# Altium project Geo tracker.PrjPcb
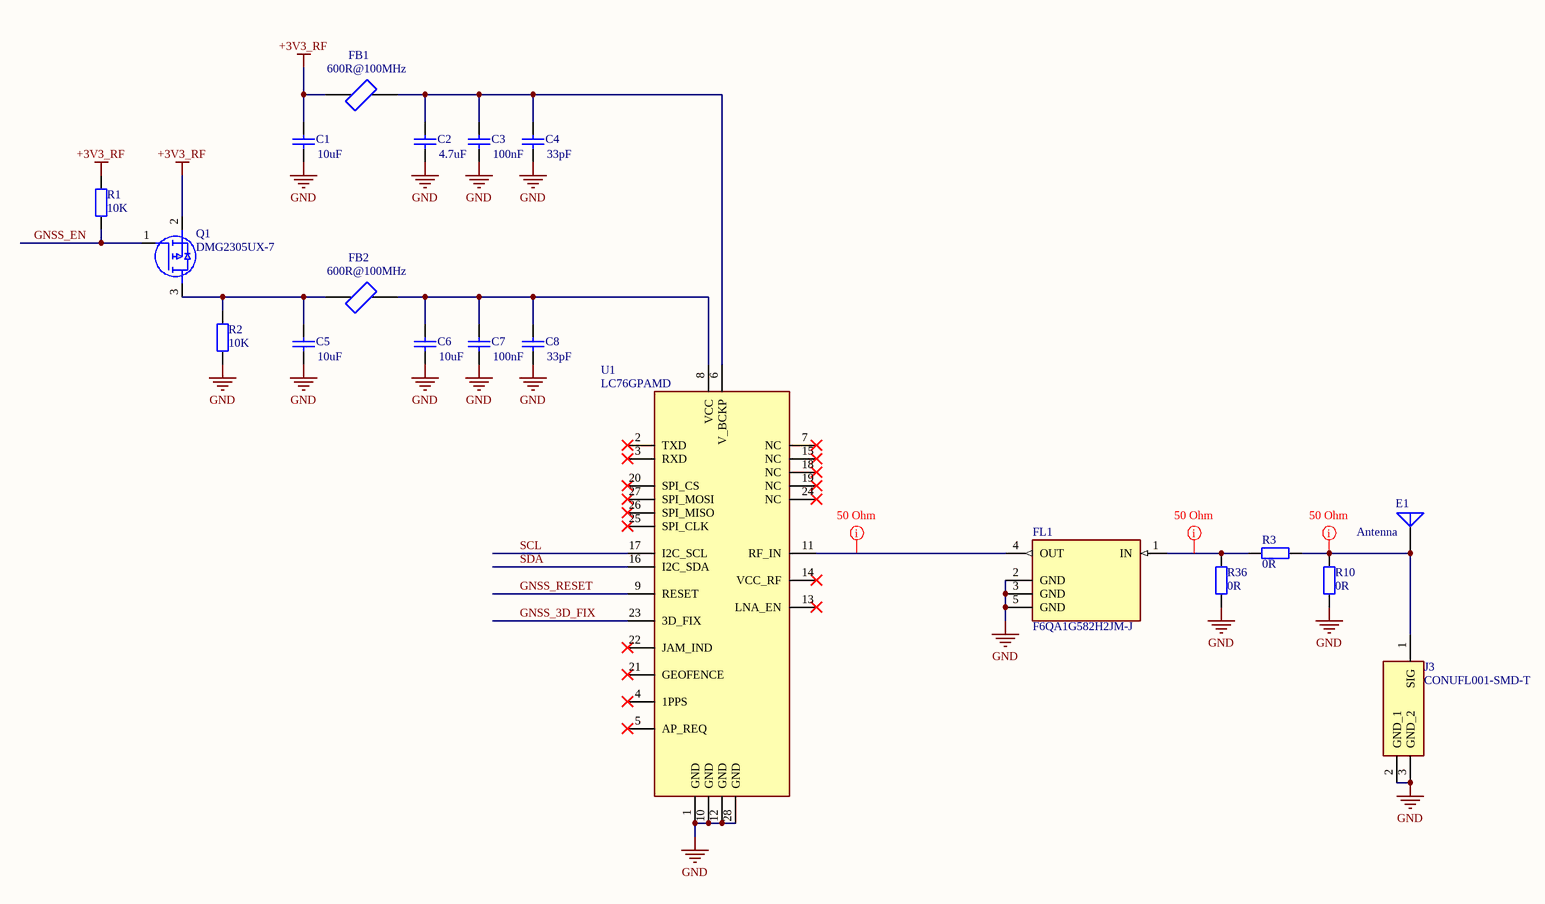
[diagram p0: GNSS modulis.SchDoc]
6 sheets, 193 parts. Net scope: global (net labels, ports and power ports of the same name join across sheets).
Board files: PCB1.PcbDoc, PCB1.PcbDoc
Sheets:
  GNSS modulis.SchDoc
  Connectors.SchDoc
  Battery charger.SchDoc
  RF Front End.SchDoc
  Power.SchDoc
  MCU.SchDoc

## Sheet GNSS modulis.SchDoc
size B; SheetNumber: 1; SheetTotal: 6

### Parts
C1  10uF  [SMD-0805C]
C2  4.7uF  [SMD-0603C]
C3  100nF  [SMD-0402C]
C4  33pF  [SMD-0402C]
C5  10uF  [SMD-0805C]
C6  10uF  [SMD-0805C]
C7  100nF  [SMD-0402C]
C8  33pF  [SMD-0402C]
E1  Antenna  [204286-0001_MOL]
FB1  600R@100MHz  [0402 Ferrite Bead]
FB2  600R@100MHz  [0402 Ferrite Bead]
FL1  F6QA1G582H2JM-J  [FIL_F6QA1G582H2JM-J]
J3  CONUFL001-SMD-T  [CONUFL001SMDT]
Q1  DMG2305UX-7  [DMG2305UX-7]
R1  10K  [SMD-0402-RES]
R2  10K  [SMD-0402-RES]
R3  0R  [SMD-0402-RES]
R10  0R  [SMD-0402-RES]
R36  0R  [SMD-0402-RES]
U1  LC76GPAMD  [LC76GPAMD]

### Nets
+3V3_RF: C1.2 FB1.1 Q1.2(S) R1.2
GND: C1.1 C2.1 C3.1 C4.1 C5.1 C6.1 C7.1 C8.1 FL1.2(GND) FL1.3(GND) FL1.5(GND) J3.2(GND_1) J3.3(GND_2) R2.1 R10.1 R36.1 U1.1(GND) U1.10(GND) U1.12(GND) U1.28(GND)
GNSS_3D_FIX: U1.23(3D_FIX)
GNSS_EN: Q1.1(G) R1.1
GNSS_RESET: U1.9(RESET)
SCL: U1.17(I2C_SCL)
SDA: U1.16(I2C_SDA)
NetC2_2: C2.2 C3.2 C4.2 FB1.2 U1.6(V_BCKP)
NetC5_2: C5.2 FB2.1 Q1.3(D) R2.2
NetC6_2: C6.2 C7.2 C8.2 FB2.2 U1.8(VCC)
NetE1_1: E1.1(A) J3.1(SIG) R3.1 R10.2
NetFL1_1: FL1.1(IN) R3.2 R36.2
NetFL1_4: FL1.4(OUT) U1.11(RF_IN)

Not connected (* = marked no-connect by the designer): U1 2(TXD)* 3(RXD)* 4(1PPS)* 5(AP_REQ)* 7(NC)* 13(LNA_EN)* 14(VCC_RF)* 15(NC)* 18(NC)* 19(NC)* 20(SPI_CS)* 21(GEOFENCE)* 22(JAM_IND)* 24(NC)* 25(SPI_CLK)* 26(SPI_MISO)* 27(SPI_MOSI)*

### Layout directives
net class 50 Ohm BLE GNSS: NetE1_1, NetFL1_1, NetFL1_4

### Library data of the parts
C1-C8 = Cap: Capacitor; Published: 8-Jun-2000; LatestRevisionDate: 17-Jul-2002; LatestRevisionNote: Re-released for DXP Platform.; PackageReference: RAD-0.3; Publisher: Altium Limited; PackageDescription: Radial Cap, Thru-Hole; 2 Leads; 0.3 in Pin Spacing; Supplier 1: Mouser
  C1 C5 C6: Value: 10uF; Supplier Part Number 1: 187-CL21A106KOQNNNG
  C2: Value: 4.7uF; Supplier Part Number 1: 187-CL10A475KO8NNNC
  C3 C7: Value: 100nF; Supplier Part Number 1: 603-CC402KRX7R7BB104
  C4 C8: Value: 33pF; Supplier Part Number 1: 81-GCM1555C1H330JA6D
E1 = Antenna: Generic Antenna; Published: 24-Mar-1999; LatestRevisionDate: 17-Jul-2002; LatestRevisionNote: Re-released for DXP Platform.; PackageReference: PIN1; Publisher: Altium Limited; Supplier 1: Mouser; Supplier Part Number 1: 538-204286-0001
FB1 FB2 = Ferrite: Ferrite Beads FERRITE BEAD 600 OHM 0402 1LN; MF: Laird-Signal Integrity Products; MP: MI0805K400R-10; SnapEDA_Link: https://www.snapeda.com/parts/MI0805K400R-10/Laird-Signal+Integrity+Products/view-part/?ref=snap; Package: 0805 Laird; Value: *; Check_prices: https://www.snapeda.com/parts/MI0805K400R-10/Laird-Signal+Integrity+Products/view-part/?ref=eda; Supplier 1: Mouser; Supplier Part Number 1: 81-BLM15AX601SN1D
FL1 = F6QA1G582H2JM-J: 1.582GHz Frequency GPS RF SAW Filter (Surface Acoustic Wave) 1.8dB  Bandwidth 5-SMD, No Lead; MF: Taiyo Yuden; SnapEDA_Link: https://www.snapeda.com/parts/F6QA1G582H2JM-J/Taiyo+Yuden/view-part/?ref=snap; Package: SMD-5 Taiyo Yuden; Value: *; MP: F6QA1G582H2JM-J; Check_prices: https://www.snapeda.com/parts/F6QA1G582H2JM-J/Taiyo+Yuden/view-part/?ref=eda; Supplier 1: Mouser; Supplier Part Number 1: 963-F6QA1G582H2JM-J
J3 = CONUFL001-SMD-T: Connector; Manufacturer_Name: TE Connectivity; Datasheet Link: https://eu.mouser.com/datasheet/2/418/9/ENG_DS_CONUFL001_SMD_T_B-3238717.pdf; Height: 1.3mm; Manufacturer_Part_Number: CONUFL001-SMD-T; Mouser Part Number: N/A; Mouser Price/Stock: https://www.mouser.co.uk/ProductDetail/TE-Connectivity/CONUFL001-SMD-T?qs=3Rah4i%252BhyCHmRzMH%252BkLkPQ%3D%3D; Arrow Part Number: CONUFL001-SMD-T; Arrow Price/Stock: https://www.arrow.com/en/products/conufl001-smd-t/te-connectivity?utm_currency=USD&region=europe; Supplier 1: Mouser; Supplier Part Number 1: 712-CONUFL001-SMD-T
Q1 = DMG2305UX-7: MOSFET P-Ch 20V 5A Enhancement SOT23 Diodes Inc DMG2305UX-7 P-channel MOSFET Transistor, -3.3 A, -20 V, 3-Pin SOT-23; Manufacturer_Name: Diodes Incorporated; Geometry.Height: 1.15mm; Mouser Part Number: 621-DMG2305UX-7; Mouser Price/Stock: https://www.mouser.co.uk/ProductDetail/Diodes-Incorporated/DMG2305UX-7?qs=L1DZKBg7t5F%2FNBHrjfxC%252Bg%3D%3D; Manufacturer_Part_Number: DMG2305UX-7; Datasheet Link: https://www.diodes.com//assets/Datasheets/DMG2305UX.pdf; Supplier 1: Mouser; Supplier Part Number 1: 621-DMG2305UX-7
R1-R3 R10 R36 = Res2: Resistor; Published: 8-Jun-2000; LatestRevisionDate: 17-Jul-2002; LatestRevisionNote: Re-released for DXP Platform.; PackageReference: AXIAL-0.4; Publisher: Altium Limited; PackageDescription: Axial Device, Thru-Hole; 2 Leads; 0.4 in Pin Spacing; Supplier 1: Mouser
  R1 R2: Value: 10K; Supplier Part Number 1: 603-RC0402FR-7D10KL
  R3 R10 R36: Value: 0R; Supplier Part Number 1: 603-RC0402FR-070RL
U1 = LC76GPAMD: Manufacturer_Name: Quectel; Datasheet Link: https://www.mouser.es/pdfDocs/L76_and_LC76_series_Hardware_Comparison_V1020220515.pdf; Height: 2.7mm; Manufacturer_Part_Number: LC76GPAMD; Mouser Part Number: 277-LC76GPAMD; Mouser Price/Stock: https://www.mouser.co.uk/ProductDetail/Quectel/LC76GPAMD?qs=vvQtp7zwQdMfDuCTmjRUww%3D%3D; Arrow Part Number: LC76GPAMD; Arrow Price/Stock: https://www.arrow.com/en/products/lc76gpamd/quectel-wireless-solutions-co-ltd?utm_currency=USD&region=nac; Supplier 1: Mouser; Supplier Part Number 1: 277-LC76GPAMD

## Sheet Connectors.SchDoc
size A; SheetNumber: 2; SheetTotal: 6
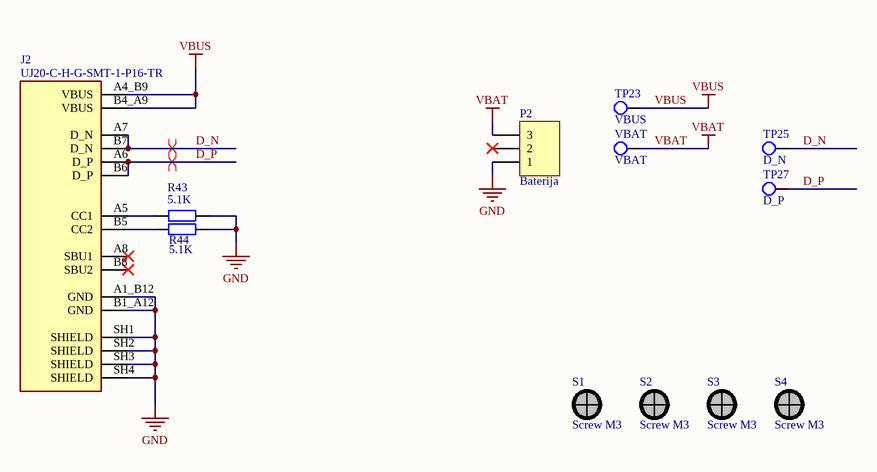
[diagram p1: Connectors.SchDoc]

### Parts
J2  UJ20-C-H-G-SMT-1-P16-TR  [SAMESKY_UJ20-C-H-G-SMT-1-P16-TR]
P2  Baterija  [S3B-XH-A-1(LF)(SN)]
R43  5.1K  [SMD-0402-RES]
R44  5.1K  [SMD-0402-RES]
S1  Screw M3  [M3]
S2  Screw M3  [M3]
S3  Screw M3  [M3]
S4  Screw M3  [M3]
TP23  VBUS  [testpoint 1 mm]  (no BOM)
TP25  D_N  [testpoint 1 mm]  (no BOM)
TP27  D_P  [testpoint 1 mm]  (no BOM)
VBAT  VBAT  [testpoint 1 mm]  (no BOM)

### Nets
GND: J2.A1_B12(GND) J2.B1_A12(GND) J2.SH1(SHIELD) J2.SH2(SHIELD) J2.SH3(SHIELD) J2.SH4(SHIELD) P2.1 R43.1 R44.1
VBAT: P2.3 VBAT.1
VBUS: J2.A4_B9(VBUS) J2.B4_A9(VBUS) TP23.1
D_N: J2.A7(D_N) J2.B7(D_N) TP25.1
D_P: J2.A6(D_P) J2.B6(D_P) TP27.1
NetJ2_A5: J2.A5(CC1) R43.2
NetJ2_B5: J2.B5(CC2) R44.2

Not connected (* = marked no-connect by the designer): J2 A8(SBU1)* B8(SBU2)*; P2 2*

### Layout directives
differential pair: D_N, D_P

### Library data of the parts
J2 = UJ20-C-H-G-SMT-1-P16-TR: USB-C (USB TYPE-C) USB 2.0 Receptacle Connector 24 (16+8 Dummy) Position Surface Mount, Right Angle; Through Hole; MF: Same Sky; SnapEDA_Link: https://www.snapeda.com/parts/UJ20-C-H-G-SMT-1-P16-TR/Same+Sky/view-part/?ref=snap; Package: None; Value: *; MP: UJ20-C-H-G-SMT-1-P16-TR; Check_prices: https://www.snapeda.com/parts/UJ20-C-H-G-SMT-1-P16-TR/Same+Sky/view-part/?ref=eda; Supplier 1: Mouser; Supplier Part Number 1: 179-UJ20CHGSMT1P16TR
P2 = Header 3: S3B-XH-A-1(LF)(SN); LatestRevisionDate: 17-Jul-2002; LatestRevisionNote: Re-released for DXP Platform.; Publisher: Altium Limited; Supplier 1: Mouser; Supplier Part Number 1: 306-S3BXHA1LFSN
R43 R44 = Res2: Resistor; Published: 8-Jun-2000; LatestRevisionDate: 17-Jul-2002; LatestRevisionNote: Re-released for DXP Platform.; PackageReference: AXIAL-0.4; Publisher: Altium Limited; PackageDescription: Axial Device, Thru-Hole; 2 Leads; 0.4 in Pin Spacing; Value: 5.1K; Supplier 1: Mouser; Supplier Part Number 1: 708-RMCF0402FT5K10
TP23 TP25 TP27 VBAT = testpoint

## Sheet Battery charger.SchDoc
size A; SheetNumber: 3; SheetTotal: 6
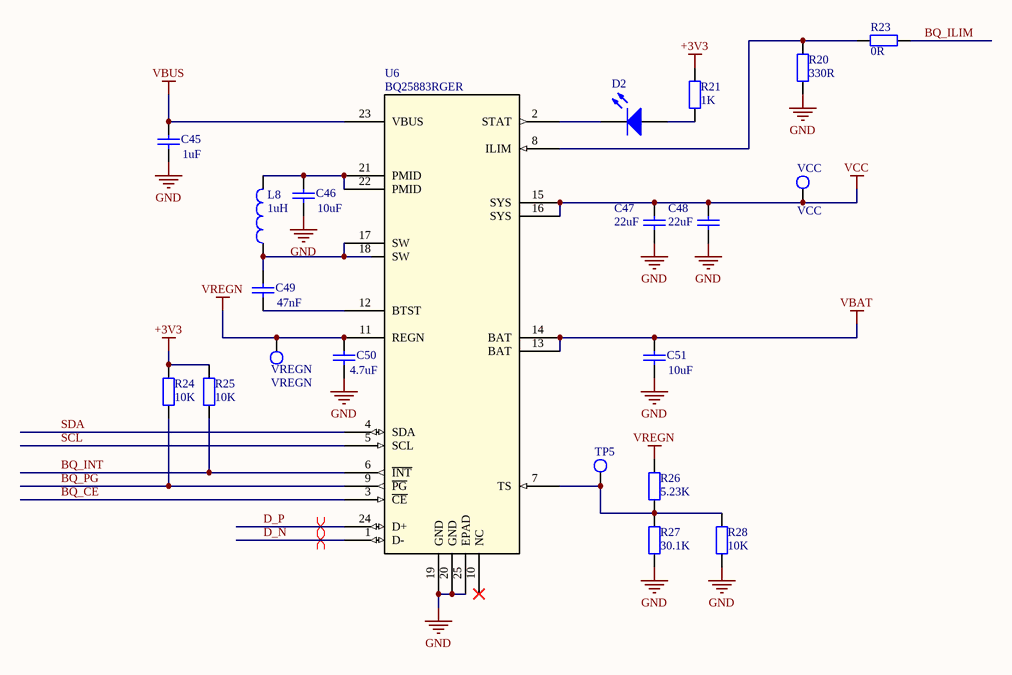
[diagram p2: Battery charger.SchDoc]

### Parts
C45  1uF  [SMD-0402C]
C46  10uF  [SMD-0805C]
C47  22uF  [SMD-0805C]
C48  22uF  [SMD-0805C]
C49  47nF  [SMD-0402C]
C50  4.7uF  [SMD-0603C]
C51  10uF  [SMD-0805C]
D2  (no value)  [LED 0603]
L8  1uH  [SMD-0806_L]
R20  330R  [SMD-0402-RES]
R21  1K  [SMD-0402-RES]
R23  0R  [SMD-0402-RES]
R24  10K  [SMD-0402-RES]
R25  10K  [SMD-0402-RES]
R26  5.23K  [SMD-0402-RES]
R27  30.1K  [SMD-0402-RES]
R28  10K  [SMD-0402-RES]
TP5  VREGN  [testpoint 1 mm]  (value not drawn)  (no BOM)
U6  BQ25883RGER  [BQ25883RGER]
VCC  VCC  [testpoint 1 mm]  (no BOM)
VREGN  VREGN  [testpoint 1 mm]  (no BOM)

### Nets
+3V3: R21.1 R24.2 R25.2
GND: C45.1 C46.1 C47.1 C48.1 C50.1 C51.1 R20.1 R27.1 R28.1 U6.19(GND) U6.20(GND) U6.25(EPAD)
VBAT: C51.2 U6.13(BAT) U6.14(BAT)
VBUS: C45.2 U6.23(VBUS)
VCC: C47.2 C48.2 U6.15(SYS) U6.16(SYS) VCC.1
VREGN: C50.2 R26.2 U6.11(REGN) VREGN.1
BQ_CE: U6.3(~{CE})
BQ_ILIM: R23.1
BQ_INT: R25.1 U6.6(~{INT})
BQ_PG: R24.1 U6.9(~{PG})
D_N: U6.1(D-)
D_P: U6.24(D+)
SCL: U6.5(SCL)
SDA: U6.4(SDA)
NetC46_2: C46.2 L8.2 U6.21(PMID) U6.22(PMID)
NetC49_1: C49.1 U6.12(BTST)
NetC49_2: C49.2 L8.1 U6.17(SW) U6.18(SW)
NetD2_1: D2.1(A) R21.2
NetD2_2: D2.2(K) U6.2(STAT)
NetR20_2: R20.2 R23.2 U6.8(ILIM)
NetR26_1: R26.1 R27.2 R28.2 TP5.1 U6.7(TS)

Not connected (* = marked no-connect by the designer): U6 10(NC)*

### Layout directives
differential pair: D_N, D_P

### Library data of the parts
C45-C51 = Cap: Capacitor; Published: 8-Jun-2000; LatestRevisionDate: 17-Jul-2002; LatestRevisionNote: Re-released for DXP Platform.; PackageReference: RAD-0.3; Publisher: Altium Limited; PackageDescription: Radial Cap, Thru-Hole; 2 Leads; 0.3 in Pin Spacing; Supplier 1: Mouser
  C45: Value: 1uF; Supplier Part Number 1: 81-GRM155R61E105KA2D
  C46 C51: Value: 10uF; Supplier Part Number 1: 187-CL21A106KOQNNNG
  C47 C48: Value: 22uF; Supplier Part Number 1: 187-CL21A226MAYNNNE
  C49: Value: 47nF; Supplier Part Number 1: 81-GRM155R71H473KE4D
  C50: Value: 4.7uF; Supplier Part Number 1: 187-CL10A475KO8NNNC
D2 = LED1: Single Colour LEDs SMD Green 2.5-16 mcd; Published: 8-Jun-2000; LatestRevisionDate: 08-Jul-2005; LatestRevisionNote: Mech Layer 1 removed.; PackageReference: LED-1; Publisher: Altium Limited; PackageDescription: LED; 2 Leads; Supplier 1: Mouser; Supplier Part Number 1: 755-SML-D12P8WT86
L8 = Inductor: Code_IEC: 1005; Published: 8-Jun-2000; LatestRevisionDate: 29-May-2009; LatestRevisionNote: IPC-7351 Footprint Added.; PackageReference: 0402-A; Publisher: Altium Limited; PackageDescription: Chip Inductor; Code_JEITA: 0402; Value: 1uH; Supplier 1: Mouser; Supplier Part Number 1: 815-AOTB201610S1R0MT
R20 R21 R23-R28 = Res2: Resistor; Published: 8-Jun-2000; LatestRevisionDate: 17-Jul-2002; LatestRevisionNote: Re-released for DXP Platform.; PackageReference: AXIAL-0.4; Publisher: Altium Limited; PackageDescription: Axial Device, Thru-Hole; 2 Leads; 0.4 in Pin Spacing; Supplier 1: Mouser
  R20: Value: 330R; Supplier Part Number 1: 652-CR0402FX-3300GLF
  R21: Value: 1K; Supplier Part Number 1: 708-RMCF0402FT1K00
  R23: Value: 0R; Supplier Part Number 1: 603-RC0402FR-070RL
  R24 R25 R28: Value: 10K; Supplier Part Number 1: 603-RC0402FR-7D10KL
  R26: Value: 5.23K; Supplier Part Number 1: 708-RMCF0402FT5K23
  R27: Value: 30.1K; Supplier Part Number 1: 708-RMCF0402FT30K1
TP5 VCC VREGN = testpoint
U6 = BQ25883RGER: I2C 2 cell 2A Boost battery charger for USB input in a WQFN package with Power Path 24-VQFN -40 to 85; Manufacturer_Name: Texas Instruments; Copyright: Copyright (C) 2025 Ultra Librarian. All rights reserved.; Manufacturer_Part_Number: BQ25883RGER; RefDes: RefDes; Type: Type; Supplier 1: Mouser; Supplier Part Number 1: 595-BQ25883RGER

## Sheet RF Front End.SchDoc
size B; SheetNumber: 4; SheetTotal: 6
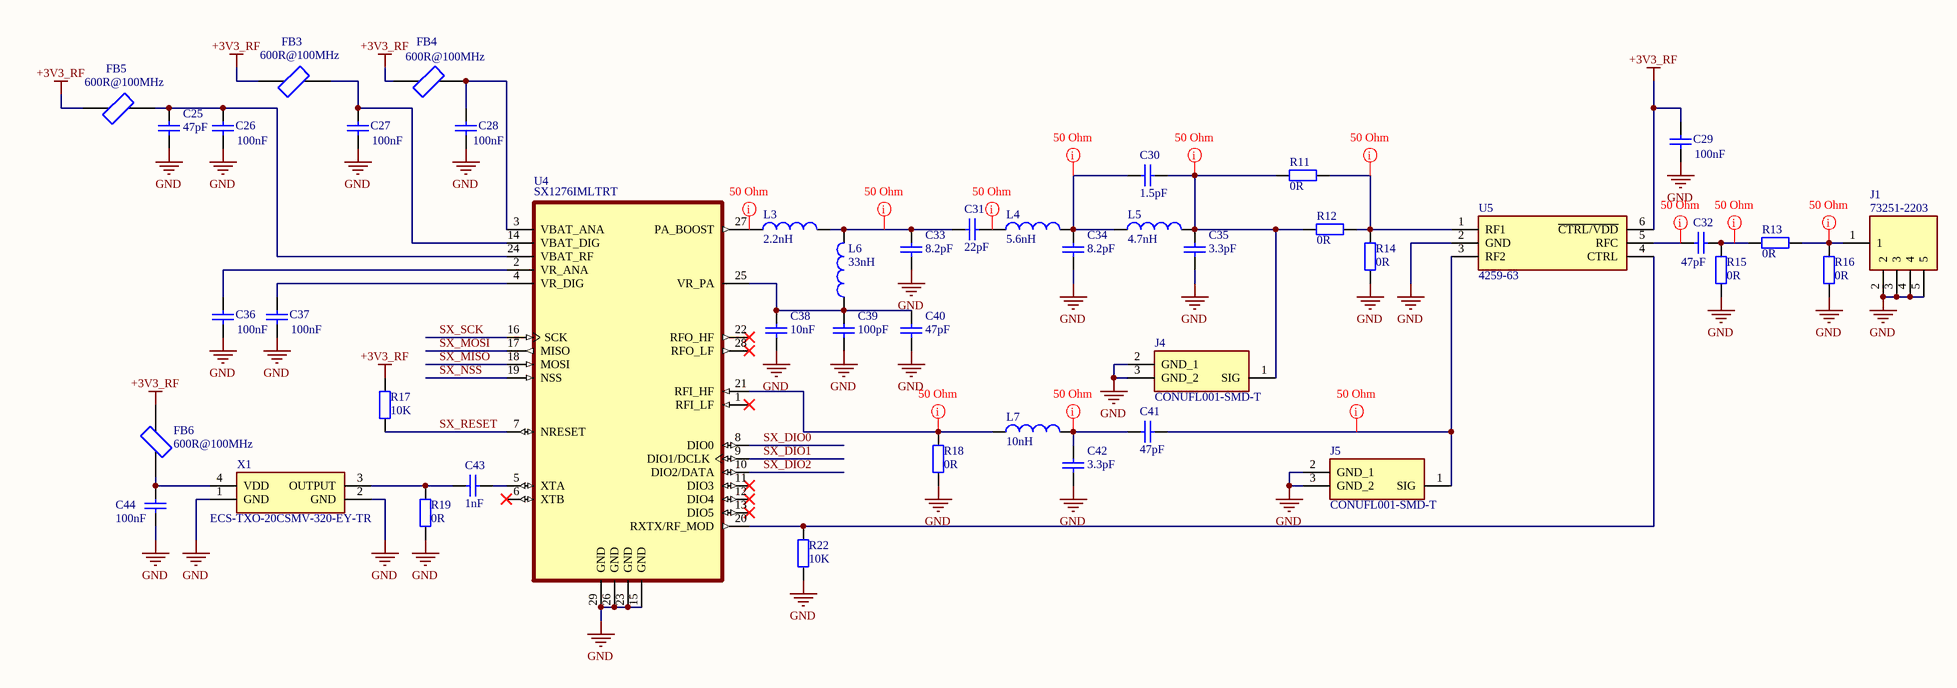
[diagram p3: RF Front End.SchDoc]

### Parts
C25  47pF  [SMD-0402C]
C26  100nF  [SMD-0402C]
C27  100nF  [SMD-0402C]
C28  100nF  [SMD-0402C]
C29  100nF  [SMD-0402C]
C30  1.5pF  [SMD-0402C]
C31  22pF  [SMD-0402C]
C32  47pF  [SMD-0402C]
C33  8.2pF  [SMD-0402C]
C34  8.2pF  [SMD-0402C]
C35  3.3pF  [SMD-0402C]
C36  100nF  [SMD-0402C]
C37  100nF  [SMD-0402C]
C38  10nF  [SMD-0402C]
C39  100pF  [SMD-0402C]
C40  47pF  [SMD-0402C]
C41  47pF  [SMD-0402C]
C42  3.3pF  [SMD-0402C]
C43  1nF  [SMD-0402C]
C44  100nF  [SMD-0402C]
FB3  600R@100MHz  [0402 Ferrite Bead]
FB4  600R@100MHz  [0402 Ferrite Bead]
FB5  600R@100MHz  [0402 Ferrite Bead]
FB6  600R@100MHz  [0402 Ferrite Bead]
J1  73251-2203  [732512203]
J4  CONUFL001-SMD-T  [CONUFL001SMDT]
J5  CONUFL001-SMD-T  [CONUFL001SMDT]
L3  2.2nH  [SMD-0402-RES]
L4  5.6nH  [SMD-0402-RES]
L5  4.7nH  [SMD-0402-RES]
L6  33nH  [SMD-0402-RES]
L7  10nH  [SMD-0402-RES]
R11  0R  [SMD-0402-RES]
R12  0R  [SMD-0402-RES]
R13  0R  [SMD-0402-RES]
R14  0R  [SMD-0402-RES]
R15  0R  [SMD-0402-RES]
R16  0R  [SMD-0402-RES]
R17  10K  [SMD-0402-RES]
R18  0R  [SMD-0402-RES]
R19  0R  [SMD-0402-RES]
R22  10K  [SMD-0402-RES]
U4  SX1276IMLTRT  [SX1276IMLTRT]
U5  4259-63  [4259-63]
X1  ECS-TXO-20CSMV-320-EY-TR  [ECS-TXO-20CSMV-320-EY-TR]

### Nets
+3V3_RF: C29.2 FB3.1 FB4.1 FB5.1 FB6.2 R17.2 U5.6(~{CTRL/}~{VDD})
GND: C25.1 C26.1 C27.1 C28.1 C29.1 C33.1 C34.1 C35.1 C36.1 C37.1 C38.1 C39.1 C40.1 C42.1 C44.1 J1.2 J1.3 J1.4 J1.5 J4.2(GND_1) J4.3(GND_2) J5.2(GND_1) J5.3(GND_2) R14.1 R15.1 R16.1 R18.1 R19.1 R22.1 U4.15(GND) U4.23(GND) U4.26(GND) U4.29(GND) U5.2(GND) X1.1(GND) X1.2(GND)
SX_DIO0: U4.8(DIO0)
SX_DIO1: U4.9(DIO1/DCLK)
SX_DIO2: U4.10(DIO2/DATA)
SX_MISO: U4.18(MOSI)
SX_MOSI: U4.17(MISO)
SX_NSS: U4.19(NSS)
SX_RESET: R17.1 U4.7(NRESET)
SX_SCK: U4.16(SCK)
NetC25_2: C25.2 C26.2 FB5.2 U4.24(VBAT_RF)
NetC27_2: C27.2 FB3.2 U4.14(VBAT_DIG)
NetC28_2: C28.2 FB4.2 U4.3(VBAT_ANA)
NetC30_1: C30.1 C35.2 J4.1(SIG) L5.2 R11.2 R12.2
NetC30_2: C30.2 C34.2 L4.2 L5.1
NetC31_1: C31.1 L4.1
NetC31_2: C31.2 C33.2 L3.2 L6.2
NetC32_1: C32.1 R13.2 R15.2
NetC32_2: C32.2 U5.5(RFC)
NetC36_2: C36.2 U4.2(VR_ANA)
NetC37_2: C37.2 U4.4(VR_DIG)
NetC38_2: C38.2 C39.2 C40.2 L6.1 U4.25(VR_PA)
NetC41_1: C41.1 J5.1(SIG) U5.3(RF2)
NetC41_2: C41.2 C42.2 L7.2
NetC43_1: C43.1 U4.5(XTA)
NetC43_2: C43.2 R19.2 X1.3(OUTPUT)
NetC44_2: C44.2 FB6.1 X1.4(VDD)
NetJ1_1: J1.1 R13.1 R16.2
NetL3_1: L3.1 U4.27(PA_BOOST)
NetL7_1: L7.1 R18.2 U4.21(RFI_HF)
NetR11_1: R11.1 R12.1 R14.2 U5.1(RF1)
NetR22_2: R22.2 U4.20(RXTX/RF_MOD) U5.4(CTRL)

Not connected (* = marked no-connect by the designer): U4 1(RFI_LF)* 6(XTB)* 11(DIO3)* 12(DIO4)* 13(DIO5)* 22(RFO_HF)* 28(RFO_LF)*

### Layout directives
net class 50 Ohm LoRa: NetC30_1, NetC30_2, NetC31_1, NetC31_2, NetC32_1, NetC32_2, NetC41_1, NetC41_2, NetJ1_1, NetL3_1, NetL7_1, NetR11_1

### Library data of the parts
C25-C44 = Cap: Capacitor; Published: 8-Jun-2000; LatestRevisionDate: 17-Jul-2002; LatestRevisionNote: Re-released for DXP Platform.; PackageReference: RAD-0.3; Publisher: Altium Limited; PackageDescription: Radial Cap, Thru-Hole; 2 Leads; 0.3 in Pin Spacing; Supplier 1: Mouser
  C25 C40: Value: 47pF; Supplier Part Number 1: 81-GRM1555C1H470JA1D
  C26-C29 C36 C37 C44: Value: 100nF; Supplier Part Number 1: 603-CC402KRX7R7BB104
  C30: Value: 1.5pF; Supplier Part Number 1: 81-GJM1555C1H1R5BB1D
  C31: Value: 22pF; Supplier Part Number 1: 81-GJM1555C1H220FB1J
  C32 C41: Value: 47pF; Supplier Part Number 1: 81-GJM1555C1H470FB1D
  C33 C34: Value: 8.2pF; Supplier Part Number 1: 81-GJM1555C1H8R2CB01
  C35 C42: Value: 3.3pF; Supplier Part Number 1: 81-GJM1555C1H3R3CB1D
  C38: Value: 10nF; Supplier Part Number 1: 791-MT15B103K500CT
  C39: Value: 100pF; Supplier Part Number 1: 187-CL05C101JB5NNNC
  C43: Value: 1nF; Supplier Part Number 1: 81-GRM36X102K50
FB3-FB6 = Ferrite: as FB1 on sheet GNSS modulis; SnapEDA_Link: https://www.snapeda.com/parts/MI0805K400R-10/Laird-Signal+Integrity+Products/view-part/?ref=snap; Package: 0805 Laird; Value: *; Check_prices: https://www.snapeda.com/parts/MI0805K400R-10/Laird-Signal+Integrity+Products/view-part/?ref=eda; Supplier 1: Mouser; Supplier Part Number 1: 81-BLM15AX601SN1D
J1 = 73251-2203: RF Connectors / Coaxial Connectors Conn 50 Ohms, SMA Jack, Right-Angle PCB, Gold; Manufacturer_Name: Molex; Geometry.Height: 10.59mm; Mouser Part Number: 538-73251-2203; Mouser Price/Stock: https://www.mouser.co.uk/ProductDetail/Molex/73251-2203?qs=KpdAywxU013Bis55GeNoeg%3D%3D; Manufacturer_Part_Number: 73251-2203; Datasheet Link: https://www.molex.com/en-us/products/part-detail-pdf/732512203?display=pdf; Supplier 1: Mouser; Supplier Part Number 1: 538-73251-2203
J4 J5 = CONUFL001-SMD-T: as J3 on sheet GNSS modulis; Datasheet Link: https://eu.mouser.com/datasheet/2/418/9/ENG_DS_CONUFL001_SMD_T_B-3238717.pdf; Height: 1.3mm; Manufacturer_Part_Number: CONUFL001-SMD-T; Mouser Part Number: N/A; Mouser Price/Stock: https://www.mouser.co.uk/ProductDetail/TE-Connectivity/CONUFL001-SMD-T?qs=3Rah4i%252BhyCHmRzMH%252BkLkPQ%3D%3D; Arrow Part Number: CONUFL001-SMD-T; Arrow Price/Stock: https://www.arrow.com/en/products/conufl001-smd-t/te-connectivity?utm_currency=USD&region=europe; Supplier 1: Mouser; Supplier Part Number 1: 712-CONUFL001-SMD-T
L3-L7 = Inductor: Code_IEC: 1005; Published: 8-Jun-2000; LatestRevisionDate: 29-May-2009; LatestRevisionNote: IPC-7351 Footprint Added.; PackageReference: 0402-A; Publisher: Altium Limited; PackageDescription: Chip Inductor; Code_JEITA: 0402; Supplier 1: Mouser
  L3: Value: 2.2nH; Supplier Part Number 1: 81-LQW15AN2N2C10D
  L4: Value: 5.6nH; Supplier Part Number 1: 81-LQW15AN5N6C10D
  L5: Value: 4.7nH; Supplier Part Number 1: 81-LQW15AN4N7B00D
  L6: Value: 33nH; Supplier Part Number 1: 81-LQW15AN33NJ00D
  L7: Value: 10nH; Supplier Part Number 1: 81-LQW15AN10NH00D
R11-R19 R22 = Res2: Resistor; Published: 8-Jun-2000; LatestRevisionDate: 17-Jul-2002; LatestRevisionNote: Re-released for DXP Platform.; PackageReference: AXIAL-0.4; Publisher: Altium Limited; PackageDescription: Axial Device, Thru-Hole; 2 Leads; 0.4 in Pin Spacing; Supplier 1: Mouser
  R11-R16 R18 R19: Value: 0R; Supplier Part Number 1: 603-RC0402FR-070RL
  R17 R22: Value: 10K; Supplier Part Number 1: 603-RC0402FR-7D10KL
U4 = SX1276IMLTRT: IC RF TxRx Only 802.15.4 LoRaâ„¢ 137MHz ~ 1.02GHz 28-VQFN Exposed Pad; MF: Semtech Corporation; SnapEDA_Link: https://www.snapeda.com/parts/SX1276IMLTRT/Semtech+Corporation/view-part/?ref=snap; Package: VQFN-28 Semtech; Value: *; MP: SX1276IMLTRT; Check_prices: https://www.snapeda.com/parts/SX1276IMLTRT/Semtech+Corporation/view-part/?ref=eda; Supplier 1: Mouser; Supplier Part Number 1: 947-SX1276IMLTRT
U5 = 4259-63: RF switch IC; Manufacturer_Name: Peregrine Semiconductor; Geometry.Height: 1.1mm; Mouser Part Number: 81-4259-63; Mouser Price/Stock: https://www.mouser.co.uk/ProductDetail/pSemi/4259-63?qs=iw0hurA%2FaD37qvQcKdATTw%3D%3D; Manufacturer_Part_Number: 4259-63; Datasheet Link: http://www.psemi.com/pdf/datasheets/pe4259ds.pdf; Supplier 1: Mouser; Supplier Part Number 1: 81-4259-63
X1 = ECS-TXO-20CSMV-320-EY-TR: TCXO Oscillators MultiVolt TCXO,32MHz,+/-2.5ppm,1.7V 3.465V,2.5 mA,-30 C 85 C, 2.00mm x 1.60mm; Manufacturer_Name: ECS; Geometry.Height: 0.8mm; Mouser Part Number: 520-TXO20CSMV320EYTR; Mouser Price/Stock: https://www.mouser.co.uk/ProductDetail/ECS/ECS-TXO-20CSMV-320-EY-TR?qs=7MVldsJ5UazLDC0xk68SAQ%3D%3D; Manufacturer_Part_Number: ECS-TXO-20CSMV-320-EY-TR; Datasheet Link: https://ecsxtal.com/store/pdf/ECS-TXO-20CSMV.pdf; Supplier 1: Mouser; Supplier Part Number 1: 520-TXO20CSMV320EYTR

## Sheet Power.SchDoc
size B; SheetNumber: 5; SheetTotal: 6
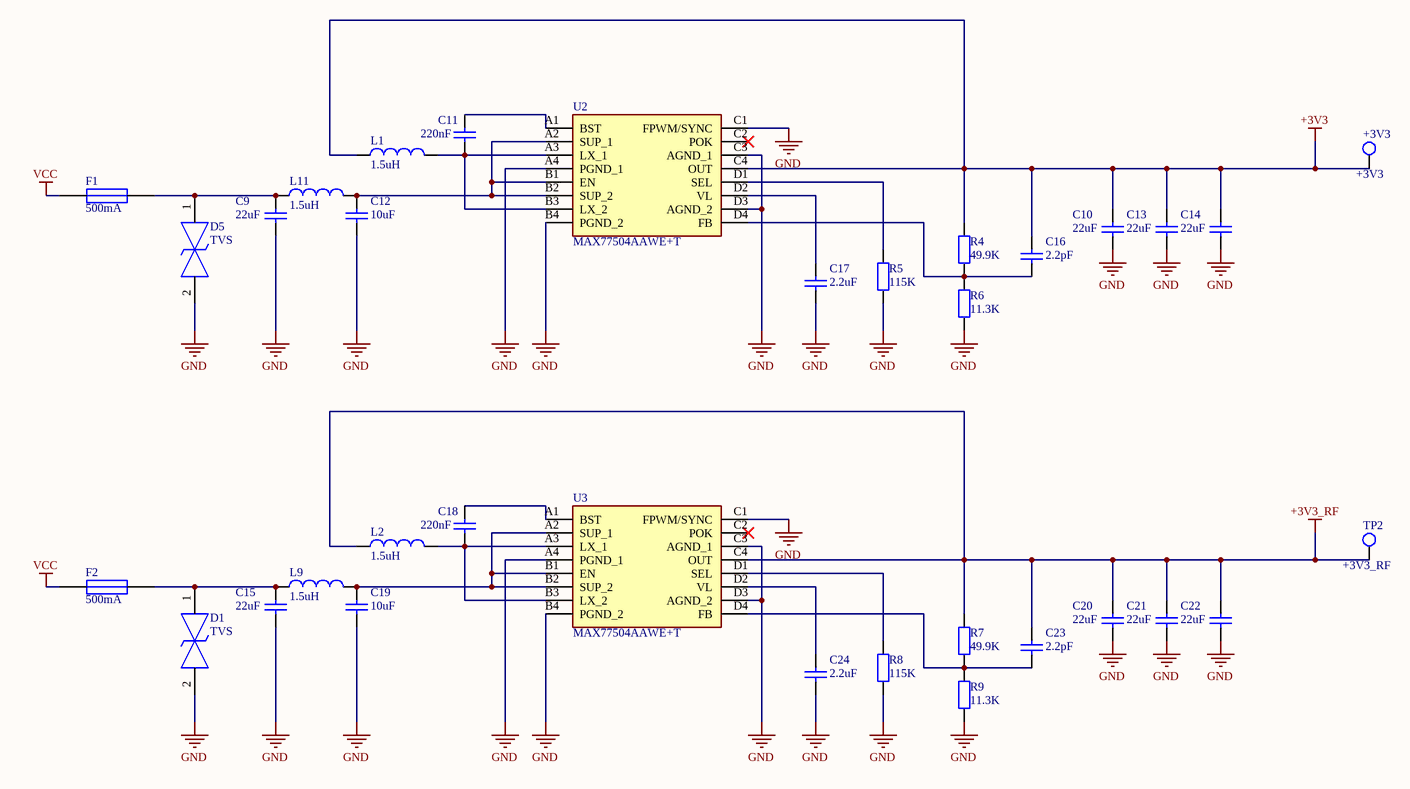
[diagram p4: Power.SchDoc]

### Parts
+3V3  +3V3  [testpoint 1 mm]  (no BOM)
C9  22uF  [SMD-0805C]
C10  22uF  [SMD-0805C]
C11  220nF  [SMD-0402C]
C12  10uF  [SMD-0805C]
C13  22uF  [SMD-0805C]
C14  22uF  [SMD-0805C]
C15  22uF  [SMD-0805C]
C16  2.2pF  [SMD-0402C]
C17  2.2uF  [SMD-0402C]
C18  220nF  [SMD-0402C]
C19  10uF  [SMD-0805C]
C20  22uF  [SMD-0805C]
C21  22uF  [SMD-0805C]
C22  22uF  [SMD-0805C]
C23  2.2pF  [SMD-0402C]
C24  2.2uF  [SMD-0402C]
D1  TVS  [TPD1E10B09DPYR]
D5  TVS  [TPD1E10B09DPYR]
F1  500mA  [SMD-1206-RES]
F2  500mA  [SMD-1206-RES]
L1  1.5uH  [SMD-0603-RES]
L2  1.5uH  [SMD-0603-RES]
L9  1.5uH  [SMD-0603-RES]
L11  1.5uH  [SMD-0603-RES]
R4  49.9K  [SMD-0402-RES]
R5  115K  [SMD-0402-RES]
R6  11.3K  [SMD-0402-RES]
R7  49.9K  [SMD-0402-RES]
R8  115K  [SMD-0402-RES]
R9  11.3K  [SMD-0402-RES]
TP2  +3V3_RF  [testpoint 1 mm]  (no BOM)
U2  MAX77504AAWE+T  [MAX77504AAWE+T]
U3  MAX77504AAWE+T  [MAX77504AAWE+T]

### Nets
+3V3: +3V3.1 C10.2 C13.2 C14.2 C16.2 L1.1 R4.2 U2.C4(OUT)
+3V3_RF: C20.2 C21.2 C22.2 C23.2 L2.1 R7.2 TP2.1 U3.C4(OUT)
GND: C9.1 C10.1 C12.1 C13.1 C14.1 C15.1 C17.1 C19.1 C20.1 C21.1 C22.1 C24.1 D1.2 D5.2 R5.1 R6.1 R8.1 R9.1 U2.A4(PGND_1) U2.B4(PGND_2) U2.C1(FPWM/SYNC) U2.C3(AGND_1) U2.D3(AGND_2) U3.A4(PGND_1) U3.B4(PGND_2) U3.C1(FPWM/SYNC) U3.C3(AGND_1) U3.D3(AGND_2)
VCC: F1.1 F2.1
NetC9_2: C9.2 D5.1 F1.2 L11.1
NetC11_1: C11.1 L1.2 U2.A3(LX_1) U2.B3(LX_2)
NetC11_2: C11.2 U2.A1(BST)
NetC12_2: C12.2 L11.2 U2.A2(SUP_1) U2.B1(EN) U2.B2(SUP_2)
NetC15_2: C15.2 D1.1 F2.2 L9.1
NetC16_1: C16.1 R4.1 R6.2 U2.D4(FB)
NetC17_2: C17.2 U2.D2(VL)
NetC18_1: C18.1 L2.2 U3.A3(LX_1) U3.B3(LX_2)
NetC18_2: C18.2 U3.A1(BST)
NetC19_2: C19.2 L9.2 U3.A2(SUP_1) U3.B1(EN) U3.B2(SUP_2)
NetC23_1: C23.1 R7.1 R9.2 U3.D4(FB)
NetC24_2: C24.2 U3.D2(VL)
NetR5_2: R5.2 U2.D1(SEL)
NetR8_2: R8.2 U3.D1(SEL)

Not connected (* = marked no-connect by the designer): U2 C2(POK)*; U3 C2(POK)*

### Library data of the parts
+3V3 TP2 = testpoint
C9-C24 = Cap: Capacitor; Published: 8-Jun-2000; LatestRevisionDate: 17-Jul-2002; LatestRevisionNote: Re-released for DXP Platform.; PackageReference: RAD-0.3; Publisher: Altium Limited; PackageDescription: Radial Cap, Thru-Hole; 2 Leads; 0.3 in Pin Spacing; Supplier 1: Mouser
  C9 C10 C13-C15 C20-C22: Value: 22uF; Supplier Part Number 1: 187-CL21A226MAYNNNE
  C11 C18: Value: 220nF; Supplier Part Number 1: 791-0402B224K160CT
  C12 C19: Value: 10uF; Supplier Part Number 1: 187-CL21A106KOQNNNG
  C16 C23: Value: 2.2pF; Supplier Part Number 1: 791-0402N2R2C500CT
  C17 C24: Value: 2.2uF; Supplier Part Number 1: 81-GRM155C81C225KE1D
D1 D5 = TPD1E10B09DPYR: TPD1E10B09DPYR / Single-Channel ESD Protection in 0402 Package With 10pF Capacitance and 9V Breakdown; Manufacturer_Name: Texas Instruments; Geometry.Height: 0.45mm; Mouser Part Number: 595-TPD1E10B09DPYR; Mouser Price/Stock: https://www.mouser.co.uk/ProductDetail/Texas-Instruments/TPD1E10B09DPYR?qs=gXEV9p%2FxLgcUO%252BNVS9qglg%3D%3D; Manufacturer_Part_Number: TPD1E10B09DPYR; Datasheet Link: http://www.ti.com/lit/gpn/tpd1e10b09; Supplier 1: Mouser; Supplier Part Number 1: 595-TPD1E10B09DPYR
F1 F2 = Fuse: JB12S5000R / Surface Mount Fuses JB12S SMD Fuse 63V 0.5A Slow 1206 3.2mm X 1.6mm; Manufacturer_Name: Bourns; Manufacturer_Part_Number: SF-1206S050-2; Geometry.Height: 0.7mm; Mouser Part Number: 652-SF-1206S050-2; Mouser Price/Stock: https://www.mouser.co.uk/ProductDetail/Bourns/SF-1206S050-2?qs=GIQXYiEeHGDImC4ULIrHHQ%3D%3D; Datasheet Link: https://altium.componentsearchengine.com/Datasheets/2/SF-1206S050-2.pdf; Supplier 1: Mouser; Supplier Part Number 1: 603-JB12S5000R
L1 L2 L9 L11 = Inductor: Code_IEC: 1005; Published: 8-Jun-2000; LatestRevisionDate: 29-May-2009; LatestRevisionNote: IPC-7351 Footprint Added.; PackageReference: 0402-A; Publisher: Altium Limited; PackageDescription: Chip Inductor; Code_JEITA: 0402; Value: 1.5uH; Supplier 1: Mouser; Supplier Part Number 1: 815-ASMPH-0603-1R5MT
R4-R9 = Res2: Resistor; Published: 8-Jun-2000; LatestRevisionDate: 17-Jul-2002; LatestRevisionNote: Re-released for DXP Platform.; PackageReference: AXIAL-0.4; Publisher: Altium Limited; PackageDescription: Axial Device, Thru-Hole; 2 Leads; 0.4 in Pin Spacing; Supplier 1: Mouser
  R4 R7: Value: 49.9K; Supplier Part Number 1: 603-RC0402FR-7W49K9L
  R5 R8: Value: 115K; Supplier Part Number 1: 708-RMCF0402FT115K
  R6 R9: Value: 11.3K; Supplier Part Number 1: 708-RMCF0402FT11K3
U2 U3 = MAX77504AAWE+T: Switching Voltage Regulators High-Efficiency Buck; Manufacturer_Name: Analog Devices; Geometry.Height: 0.69mm; Mouser Part Number: 700-MAX77504AAWE+T; Mouser Price/Stock: https://www.mouser.co.uk/ProductDetail/Maxim-Integrated/MAX77504AAWE%2bT?qs=xZ%2FP%252Ba9zWqZtt7v5b08uMg%3D%3D; Manufacturer_Part_Number: MAX77504AAWE+T; Datasheet Link: https://pdfserv.maximintegrated.com/en/ds/MAX77504.pdf; Supplier 1: Mouser; Supplier Part Number 1: 700-MAX77504AAWE+T

## Sheet MCU.SchDoc
size B; SheetNumber: 6; SheetTotal: 6; SPICEModelCacheVOGBEKYM: <root> / <DocumentId>VOGBEKYM</DocumentId> / <CacheFrame Number="0"> / <Model Name="xtal" Kind="CKT"> / <Text>*Generic type:crystal pkg:HC33/51 / .SUBCKT XTAL 1 2 PARAMS: FREQ=1Meg RS=750 C=13pf Q=1000 / LX 1 3 {((Q*RS)/(6.2831852*FREQ))} IC=0.5M / CX 3 4 {(1/(Q*6.2831852*FREQ*RS))} / C0 1 2 {C} / RS 4 2 {RS} / .ENDS XTAL</Text> / </Model> / <Model Name="led1" Kind="MDL"> / <Text>*Typ RED GaAs LED: Vf=1.7V Vr=4V If=40mA trr=3uS / *LED Pinout: 1=A, 2=K / .MODEL LED1 D (IS=93.2P RS=42M N=3.73 BV=4 IBV=10U / + CJO=2.97P VJ=.75 M=.333 TT=4.32U)</Text> / </Model> / </CacheFrame> / </root>
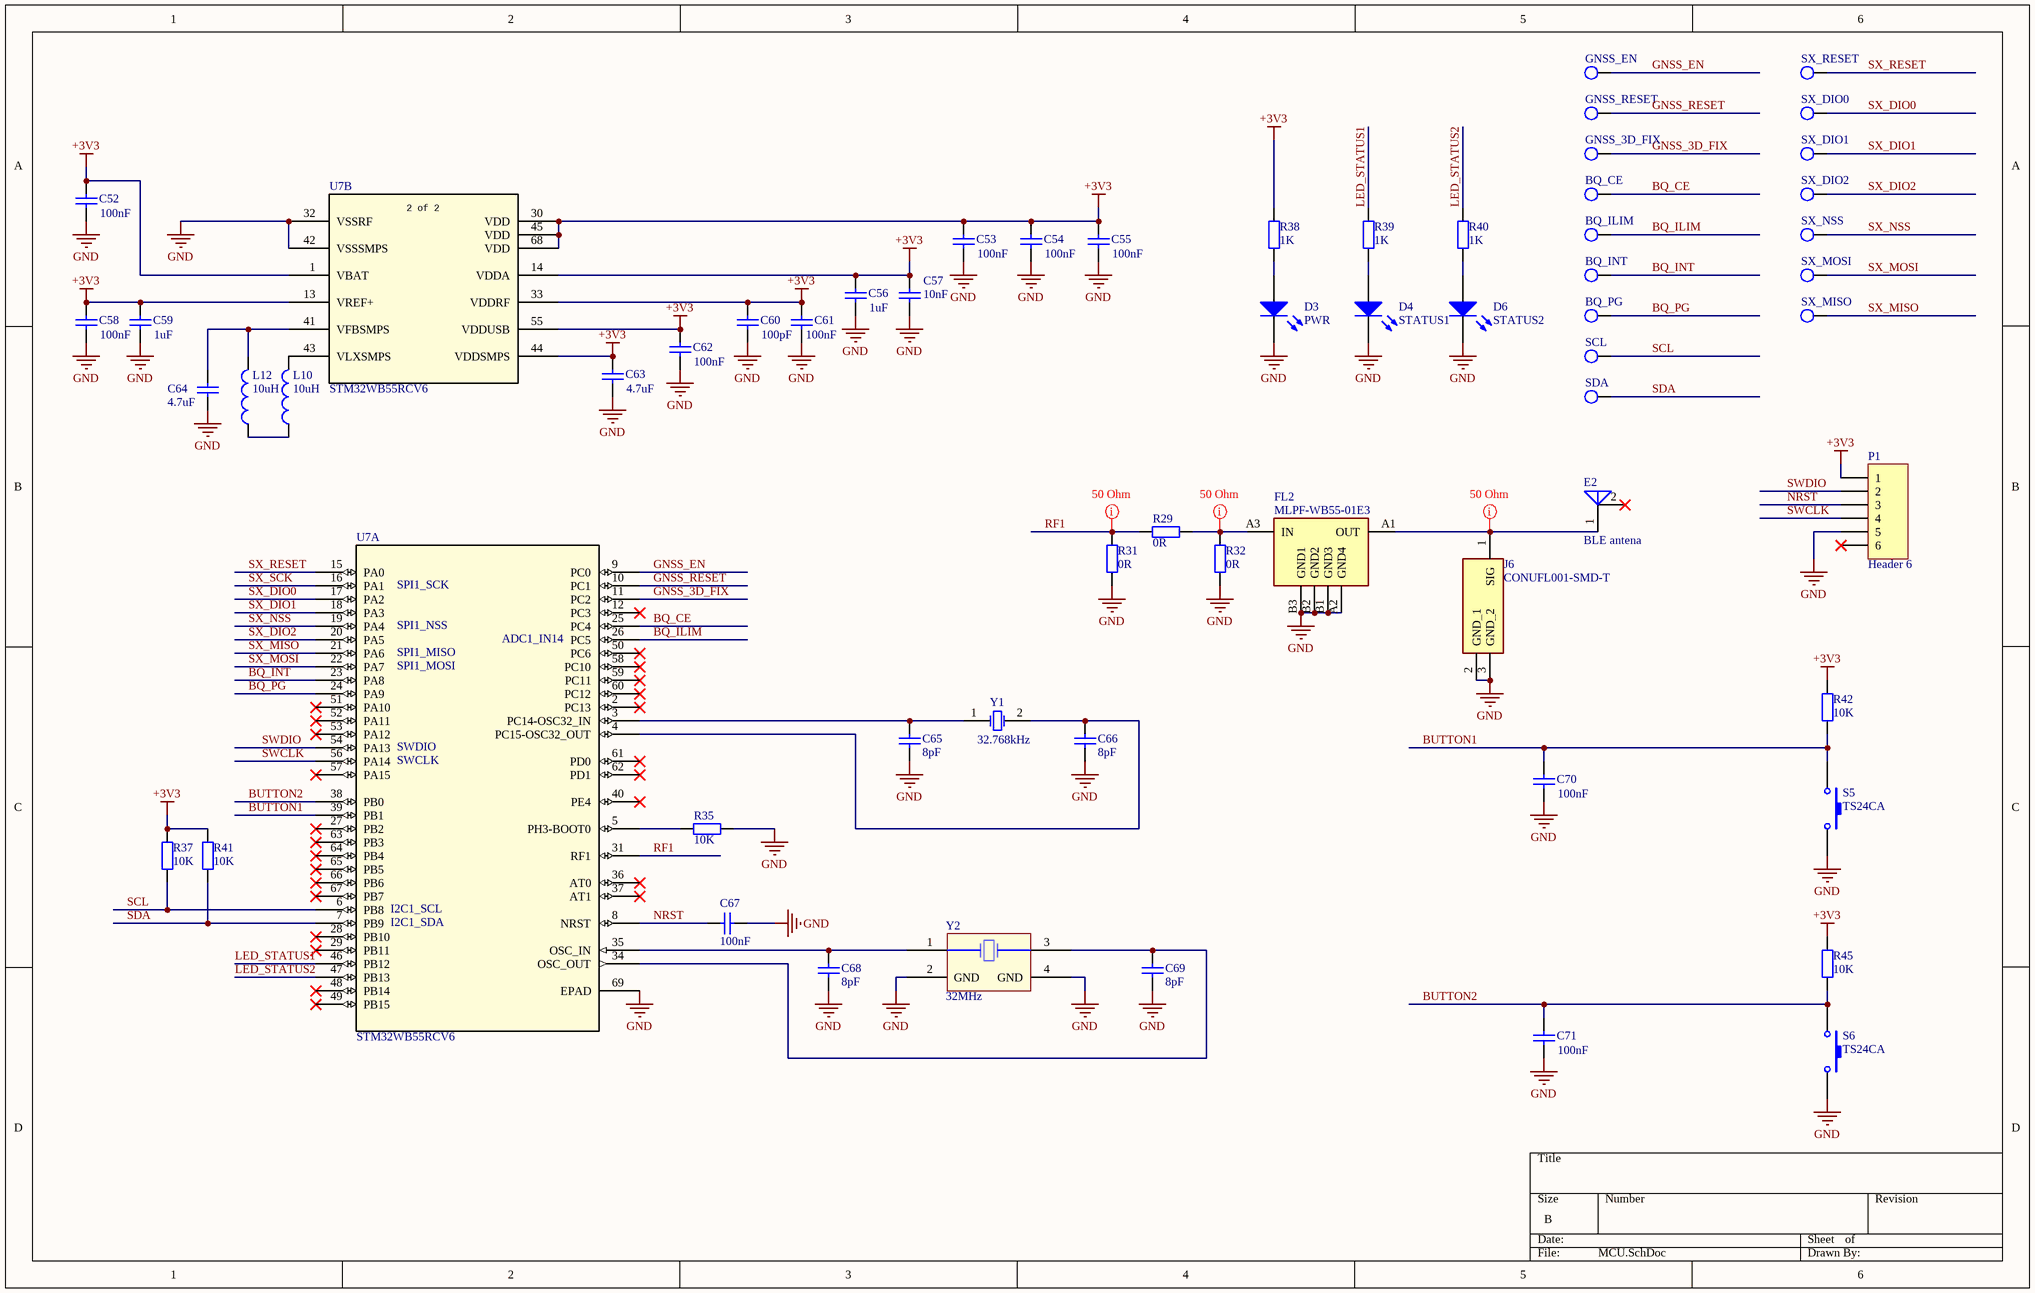
[diagram p5: MCU.SchDoc]

### Parts
BQ_CE  BQ_CE  [testpoint 1 mm]  (value not drawn)  (no BOM)
BQ_ILIM  BQ_ILIM  [testpoint 1 mm]  (value not drawn)  (no BOM)
BQ_INT  BQ_INT  [testpoint 1 mm]  (value not drawn)  (no BOM)
BQ_PG  BQ_PG  [testpoint 1 mm]  (value not drawn)  (no BOM)
C52  100nF  [SMD-0402C]
C53  100nF  [SMD-0402C]
C54  100nF  [SMD-0402C]
C55  100nF  [SMD-0402C]
C56  1uF  [SMD-0402C]
C57  10nF  [SMD-0402C]
C58  100nF  [SMD-0402C]
C59  1uF  [SMD-0402C]
C60  100pF  [SMD-0402C]
C61  100nF  [SMD-0402C]
C62  100nF  [SMD-0402C]
C63  4.7uF  [SMD-0603C]
C64  4.7uF  [SMD-0603C]
C65  8pF  [SMD-0402C]
C66  8pF  [SMD-0402C]
C67  100nF  [SMD-0402C]
C68  8pF  [SMD-0402C]
C69  8pF  [SMD-0402C]
C70  100nF  [SMD-0402C]
C71  100nF  [SMD-0402C]
D3  PWR  [LED 0603]
D4  STATUS1  [LED 0603]
D6  STATUS2  [LED 0603]
E2  BLE antena  [ANT3216LL00R2400A]
FL2  MLPF-WB55-01E3  [MLPF-WB55-01E3]
GNSS_3D_FIX  GNSS_EN  [testpoint 1 mm]  (value not drawn)  (no BOM)
GNSS_EN  GNSS_EN  [testpoint 1 mm]  (value not drawn)  (no BOM)
GNSS_RESET  GNSS_RESET  [testpoint 1 mm]  (value not drawn)  (no BOM)
J6  CONUFL001-SMD-T  [CONUFL001SMDT]
L10  10uH  [SMD-0805-RES]
L12  10uH  [SMD-0805-RES]
P1  Header 6  [TAG_TC2030-IDC-NL]
R29  0R  [SMD-0402-RES]
R31  0R  [SMD-0402-RES]
R32  0R  [SMD-0402-RES]
R35  10K  [SMD-0402-RES]
R37  10K  [SMD-0402-RES]
R38  1K  [SMD-0402-RES]
R39  1K  [SMD-0402-RES]
R40  1K  [SMD-0402-RES]
R41  10K  [SMD-0402-RES]
R42  10K  [SMD-0402-RES]
R45  10K  [SMD-0402-RES]
S5  TS24CA  [TS24CA]
S6  TS24CA  [TS24CA]
SCL  SCL  [testpoint 1 mm]  (value not drawn)  (no BOM)
SDA  SDA  [testpoint 1 mm]  (value not drawn)  (no BOM)
SX_DIO0  SX_DIO0  [testpoint 1 mm]  (value not drawn)  (no BOM)
SX_DIO1  SX_DIO1  [testpoint 1 mm]  (value not drawn)  (no BOM)
SX_DIO2  SX_DIO2  [testpoint 1 mm]  (value not drawn)  (no BOM)
SX_MISO  SX_MISO  [testpoint 1 mm]  (value not drawn)  (no BOM)
SX_MOSI  SX_MOSI  [testpoint 1 mm]  (value not drawn)  (no BOM)
SX_NSS  SX_NSS  [testpoint 1 mm]  (value not drawn)  (no BOM)
SX_RESET  SX_RESET  [testpoint 1 mm]  (value not drawn)  (no BOM)
U7  STM32WB55RCV6  [STM32WB55RCV6]  (parts A,B of 2)
Y1  32.768kHz  [DT1610SB32768B0HPWAA]
Y2  32MHz  [ECS-TXO-20CSMV-320-EY-TR]

### Nets
+3V3: C52.2 C53.2 C54.2 C55.2 C56.2 C57.2 C58.2 C59.2 C60.2 C61.2 C62.2 C63.2 P1.1 R37.2 R38.1 R41.2 R42.2 R45.2 U7.1(VBAT) U7.13(VREF+) U7.14(VDDA) U7.30(VDD) U7.33(VDDRF) U7.44(VDDSMPS) U7.45(VDD) U7.55(VDDUSB) U7.68(VDD)
GND: C52.1 C53.1 C54.1 C55.1 C56.1 C57.1 C58.1 C59.1 C60.1 C61.1 C62.1 C63.1 C64.1 C65.2 C66.2 C67.1 C68.2 C69.2 C70.1 C71.1 D3.2(K) D4.2(K) D6.2(K) FL2.A2(GND4) FL2.B1(GND3) FL2.B2(GND2) FL2.B3(GND1) J6.2(GND_1) J6.3(GND_2) P1.5 R31.1 R32.1 R35.1 S5.2 S6.2 U7.32(VSSRF) U7.42(VSSSMPS) U7.69(EPAD) Y2.2(GND) Y2.4(GND)
BQ_CE: BQ_CE.1 U7.25(PC4)
BQ_ILIM: BQ_ILIM.1 U7.26(PC5)
BQ_INT: BQ_INT.1 U7.23(PA8)
BQ_PG: BQ_PG.1 U7.24(PA9)
BUTTON1: C70.2 R42.1 S5.1 U7.39(PB1)
BUTTON2: C71.2 R45.1 S6.1 U7.38(PB0)
GNSS_3D_FIX: GNSS_3D_FIX.1 U7.11(PC2)
GNSS_EN: GNSS_EN.1 U7.9(PC0)
GNSS_RESET: GNSS_RESET.1 U7.10(PC1)
LED_STATUS1: R39.1 U7.46(PB12)
LED_STATUS2: R40.1 U7.47(PB13)
NRST: C67.2 P1.3 U7.8(NRST)
RF1: R29.2 R31.2 U7.31(RF1)
SCL: R37.1 SCL.1 U7.6(PB8)
SDA: R41.1 SDA.1 U7.7(PB9)
SWCLK: P1.4 U7.56(PA14)
SWDIO: P1.2 U7.54(PA13)
SX_DIO0: SX_DIO0.1 U7.17(PA2)
SX_DIO1: SX_DIO1.1 U7.18(PA3)
SX_DIO2: SX_DIO2.1 U7.20(PA5)
SX_MISO: SX_MISO.1 U7.21(PA6)
SX_MOSI: SX_MOSI.1 U7.22(PA7)
SX_NSS: SX_NSS.1 U7.19(PA4)
SX_RESET: SX_RESET.1 U7.15(PA0)
SX_SCK: U7.16(PA1)
NetC64_2: C64.2 L12.2 U7.41(VFBSMPS)
NetC65_1: C65.1 U7.3(PC14-OSC32_IN) Y1.1(OSC1)
NetC66_1: C66.1 U7.4(PC15-OSC32_OUT) Y1.2(OSC2)
NetC68_1: C68.1 U7.35(OSC_IN) Y2.1
NetC69_1: C69.1 U7.34(OSC_OUT) Y2.3
NetD3_1: D3.1(A) R38.2
NetD4_1: D4.1(A) R39.2
NetD6_1: D6.1(A) R40.2
NetE2_1: E2.1 FL2.A1(OUT) J6.1(SIG)
NetFL2_A3: FL2.A3(IN) R29.1 R32.2
NetL10_1: L10.1 L12.1
NetL10_2: L10.2 U7.43(VLXSMPS)
NetR35_2: R35.2 U7.5(PH3-BOOT0)

Not connected (* = marked no-connect by the designer): E2 2*; P1 6*; U7 2(PC13)* 12(PC3)* 27(PB2)* 28(PB10)* 29(PB11)* 36(AT0)* 37(AT1)* 40(PE4)* 48(PB14)* 49(PB15)* 50(PC6)* 51(PA10)* 52(PA11)* 53(PA12)* 57(PA15)* 58(PC10)* 59(PC11)* 60(PC12)* 61(PD0)* 62(PD1)* 63(PB3)* 64(PB4)* 65(PB5)* 66(PB6)* 67(PB7)*

### Layout directives
net class 50 Ohm BLE GNSS: NetE2_1, NetFL2_A3, RF1

### Notes on the sheet
- (in symbol STM32WB55RCV6, part B) 2 of 2
- (in symbol STM32WB55RCV6, part A) SPI1_SCK; SPI1_NSS; ADC1_IN14; SPI1_MISO; SPI1_MOSI; SWDIO; SWCLK; I2C1_SCL; I2C1_SDA

### Library data of the parts
BQ_CE BQ_ILIM BQ_INT BQ_PG GNSS_3D_FIX GNSS_EN GNSS_RESET SCL SDA SX_DIO0-SX_DIO2 SX_MISO SX_MOSI SX_NSS SX_RESET = testpoint
C52-C71 = Cap: Capacitor; Published: 8-Jun-2000; LatestRevisionDate: 17-Jul-2002; LatestRevisionNote: Re-released for DXP Platform.; PackageReference: RAD-0.3; Publisher: Altium Limited; PackageDescription: Radial Cap, Thru-Hole; 2 Leads; 0.3 in Pin Spacing; Supplier 1: Mouser
  C52-C55 C58 C61 C62 C67 C70 C71: Value: 100nF; Supplier Part Number 1: 603-CC402KRX7R7BB104
  C56 C59: Value: 1uF; Supplier Part Number 1: 81-GRM155R61E105KA2D
  C57: Value: 10nF; Supplier Part Number 1: 791-MT15B103K500CT
  C60: Value: 100pF; Supplier Part Number 1: 80-C0402C101J5GAC
  C63 C64: Value: 4.7uF; Supplier Part Number 1: 187-CL10A475KO8NNNC
  C65 C66 C68 C69: Value: 8pF; Supplier Part Number 1: 791-0402N8R0D500CT
D3 D4 D6 = LED1: Single Colour LEDs SMD Green 2.5-16 mcd; Published: 8-Jun-2000; LatestRevisionDate: 08-Jul-2005; LatestRevisionNote: Mech Layer 1 removed.; PackageReference: LED-1; Publisher: Altium Limited; PackageDescription: LED; 2 Leads; Supplier 1: Mouser; Supplier Part Number 1: 755-SML-D12P8WT86
E2 = Antenna: ANT3216LL00R2400A; Supplier 1: Mouser; Supplier Part Number 1: 603-ANT3216LL00R2400
FL2 = MLPF-WB55-01E3: Manufacturer_Name: STMicroelectronics; Datasheet Link: https://www.st.com/resource/en/datasheet/mlpf-wb55-01e3.pdf; Manufacturer_Part_Number: MLPF-WB55-01E3; Mouser Part Number: 511-MLPF-WB55-01E3; Mouser Price/Stock: https://www.mouser.co.uk/ProductDetail/STMicroelectronics/MLPF-WB55-01E3?qs=vLWxofP3U2xV%2FkxL9PmCDA%3D%3D; Arrow Part Number: MLPF-WB55-01E3; Arrow Price/Stock: https://www.arrow.com/en/products/mlpf-wb55-01e3/stmicroelectronics?utm_currency=USD&region=nac; Supplier 1: Mouser; Supplier Part Number 1: 511-MLPF-WB55-01E3
J6 = CONUFL001-SMD-T: as J3 on sheet GNSS modulis; Datasheet Link: https://eu.mouser.com/datasheet/2/418/9/ENG_DS_CONUFL001_SMD_T_B-3238717.pdf; Height: 1.3mm; Manufacturer_Part_Number: CONUFL001-SMD-T; Mouser Part Number: N/A; Mouser Price/Stock: https://www.mouser.co.uk/ProductDetail/TE-Connectivity/CONUFL001-SMD-T?qs=3Rah4i%252BhyCHmRzMH%252BkLkPQ%3D%3D; Arrow Part Number: CONUFL001-SMD-T; Arrow Price/Stock: https://www.arrow.com/en/products/conufl001-smd-t/te-connectivity?utm_currency=USD&region=europe; Supplier 1: Mouser; Supplier Part Number 1: 712-CONUFL001-SMD-T
L10 L12 = Inductor: Code_IEC: 1005; Published: 8-Jun-2000; LatestRevisionDate: 29-May-2009; LatestRevisionNote: IPC-7351 Footprint Added.; PackageReference: 0402-A; Publisher: Altium Limited; PackageDescription: Chip Inductor; Code_JEITA: 0402; Value: 10uH; Supplier 1: Mouser; Supplier Part Number 1: 81-LQM21DH100M70L
P1 = Header 6: Header, 6-Pin; LatestRevisionDate: 17-Jul-2002; LatestRevisionNote: Re-released for DXP Platform.; Publisher: Altium Limited
R29 R31 R32 R35 R37-R42 R45 = Res2: Resistor; Published: 8-Jun-2000; LatestRevisionDate: 17-Jul-2002; LatestRevisionNote: Re-released for DXP Platform.; PackageReference: AXIAL-0.4; Publisher: Altium Limited; PackageDescription: Axial Device, Thru-Hole; 2 Leads; 0.4 in Pin Spacing; Supplier 1: Mouser
  R29 R31 R32: Value: 0R; Supplier Part Number 1: 603-RC0402FR-070RL
  R35 R37 R41 R42 R45: Value: 10K; Supplier Part Number 1: 603-RC0402FR-7D10KL
  R38-R40: Value: 1K; Supplier Part Number 1: 708-RMCF0402FT1K00
S5 S6 = SW-PB: Switch; Published: 24-Mar-1999; LatestRevisionDate: 17-Jul-2002; LatestRevisionNote: Re-released for DXP Platform.; PackageReference: SPST-2; Publisher: Altium Limited; PackageDescription: Switch; 2 Leads
U7 = STM32WB55RCV6: Ultra-low-power dual core Arm Cortex-M4 MCU 64 MHz, Cortex-M0+ 32 MHz with 256 Kbytes of Flash memory, Bluetooth LE 5.4, 802.15.4, Zigbee, Thread, Matter, USB, LCD, AES-256; Manufacturer_Name: STMicroelectronics; Copyright: Copyright (C) 2025 Ultra Librarian. All rights reserved.; Manufacturer_Part_Number: STM32WB55RCV6; RefDes: RefDes; Type: Type
Y1 = XTAL: Crystal Oscillator / CM8V-T1A-32.768kHz-7pF-20PPM-TA-QC; Published: 8-Jun-2000; LatestRevisionDate: 17-Jul-2002; LatestRevisionNote: Re-released for DXP Platform.; PackageReference: R38; Publisher: Altium Limited; PackageDescription: Crystal, Thru-Hole; 2 Leads; Body 3.1 x 8.2 mm (Dia.xH); Supplier 1: Mouser; Supplier Part Number 1: 581-DT1610SB32768B0H
Y2 = Xtal 4 pin: ECS-320-8-37B2-CGP-TR / Crystals 32.000 MHz 8 pF ECX-1637B2 +/-10/30ppm -40 - +105C +/-2 ppm Aging 2016 4-SMD RoHS; Supplier 1: Mouser; Supplier Part Number 1: 520-320-8-37B2-CGPTR

## Nets that join several sheets
+3V3: Battery charger (R21.1 R24.2 R25.2), Power (8 pins), MCU (27 pins)
+3V3_RF: GNSS modulis (C1.2 FB1.1 Q1.2 R1.2), RF Front End (7 pins), Power (8 pins)
GND: GNSS modulis (20 pins), Connectors (9 pins), Battery charger (12 pins), RF Front End (36 pins), Power (28 pins), MCU (40 pins)
VBAT: Connectors (P2.3 VBAT.1), Battery charger (C51.2 U6.13 U6.14)
VBUS: Connectors (J2.A4_B9 J2.B4_A9 TP23.1), Battery charger (C45.2 U6.23)
VCC: Battery charger (5 pins), Power (F1.1 F2.1)
BQ_CE: Battery charger (U6.3), MCU (BQ_CE.1 U7.25)
BQ_ILIM: Battery charger (R23.1), MCU (BQ_ILIM.1 U7.26)
BQ_INT: Battery charger (R25.1 U6.6), MCU (BQ_INT.1 U7.23)
BQ_PG: Battery charger (R24.1 U6.9), MCU (BQ_PG.1 U7.24)
D_N: Connectors (J2.A7 J2.B7 TP25.1), Battery charger (U6.1)
D_P: Connectors (J2.A6 J2.B6 TP27.1), Battery charger (U6.24)
GNSS_3D_FIX: GNSS modulis (U1.23), MCU (GNSS_3D_FIX.1 U7.11)
GNSS_EN: GNSS modulis (Q1.1 R1.1), MCU (GNSS_EN.1 U7.9)
GNSS_RESET: GNSS modulis (U1.9), MCU (GNSS_RESET.1 U7.10)
SCL: GNSS modulis (U1.17), Battery charger (U6.5), MCU (R37.1 SCL.1 U7.6)
SDA: GNSS modulis (U1.16), Battery charger (U6.4), MCU (R41.1 SDA.1 U7.7)
SX_DIO0: RF Front End (U4.8), MCU (SX_DIO0.1 U7.17)
SX_DIO1: RF Front End (U4.9), MCU (SX_DIO1.1 U7.18)
SX_DIO2: RF Front End (U4.10), MCU (SX_DIO2.1 U7.20)
SX_MISO: RF Front End (U4.18), MCU (SX_MISO.1 U7.21)
SX_MOSI: RF Front End (U4.17), MCU (SX_MOSI.1 U7.22)
SX_NSS: RF Front End (U4.19), MCU (SX_NSS.1 U7.19)
SX_RESET: RF Front End (R17.1 U4.7), MCU (SX_RESET.1 U7.15)
SX_SCK: RF Front End (U4.16), MCU (U7.16)

## Assembly variants
DNP: not fitted R10 R11 R14 R15 R16 R18 R19 R31 R32 R36